# Altium schematic sheet Sheet2.SchDoc
size A4
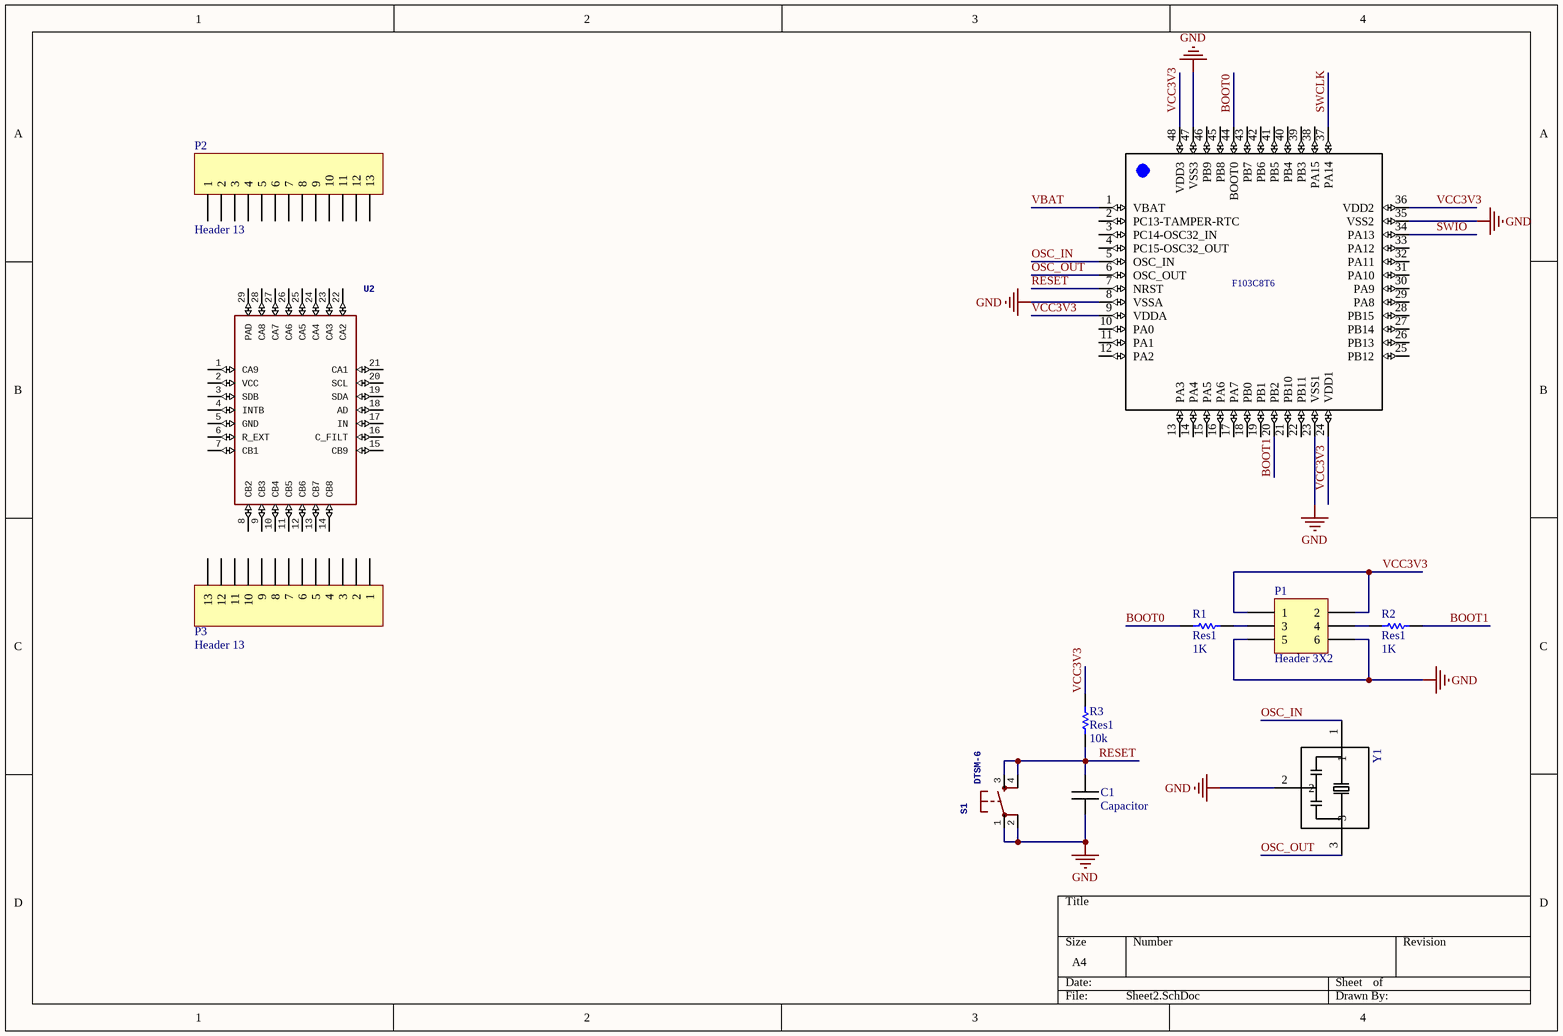
[diagram p0: Sheet2.SchDoc]

## Parts
C1  Capacitor  [C 0603 / 1608]
P1  Header 3X2  [HDR2X3]
P2  Header 13  [HDR1X13]
P3  Header 13  [HDR1X13]
R1  Res1  value 1K  [C 0603 / 1608]
R2  Res1  value 1K  [C 0603 / 1608]
R3  Res1  value 10k  [C 0603 / 1608]
S1  DTSM-6  [DTSM-6]
U1  STM32F103C8T6  [LQFP48_7X7MM_0.5MMPP]  (value not drawn)
U2  LED Lighting Drivers LED Driver   Source:  Datasheet  [QFN40P400X400X80-29N]  (value not drawn)
Y1  (no value)  [OSC_CSTCE8M00G55-R0]

## Nets
GND: C1.2 P1.5 P1.6 S1.1 S1.2 U1.8(VSSA) U1.23(VSS1) U1.35(VSS2) U1.47(VSS3) Y1.2
BOOT0: R1.1 U1.44(BOOT0)
BOOT1: R2.2 U1.20(PB2)
OSC_IN: U1.5(OSC_IN) Y1.1
OSC_OUT: U1.6(OSC_OUT) Y1.3
RESET: C1.1 R3.2 S1.3 S1.4 U1.7(NRST)
SWCLK: U1.37(PA14)
SWIO: U1.34(PA13)
VBAT: U1.1(VBAT)
VCC3V3: P1.1 P1.2 R3.1 U1.9(VDDA) U1.24(VDD1) U1.36(VDD2) U1.48(VDD3)
NetP1_3: P1.3 R1.2
NetP1_4: P1.4 R2.1

Not connected (* = marked no-connect by the designer): P2 1 2 3 4 5 6 7 8 9 10 11 12 13; P3 1 2 3 4 5 6 7 8 9 10 11 12 13; U1 2(PC13-TAMPER-RTC) 3(PC14-OSC32_IN) 4(PC15-OSC32_OUT) 10(PA0) 11(PA1) 12(PA2) 13(PA3) 14(PA4) 15(PA5) 16(PA6) 17(PA7) 18(PB0) 19(PB1) 21(PB10) 22(PB11) 25(PB12) 26(PB13) 27(PB14) 28(PB15) 29(PA8) 30(PA9) 31(PA10) 32(PA11) 33(PA12) 38(PA15) 39(PB3) 40(PB4) 41(PB5) 42(PB6) 43(PB7) 45(PB8) 46(PB9); U2 1(CA9) 2(VCC) 3(SDB) 4(INTB) 5(GND) 6(R_EXT) 7(CB1) 8(CB2) 9(CB3) 10(CB4) 11(CB5) 12(CB6) 13(CB7) 14(CB8) 15(CB9) 16(C_FILT) 17(IN) 18(AD) 19(SDA) 20(SCL) 21(CA1) 22(CA2) 23(CA3) 24(CA4) 25(CA5) 26(CA6) 27(CA7) 28(CA8) 29(PAD)

## Notes on the sheet
- (in symbol STM32F103C8T6) F103C8T6

## Library data of the parts
P1 = Header 3X2: Header, 3-Pin, Dual row; LatestRevisionDate: 17-Jul-2002; LatestRevisionNote: Re-released for DXP Platform.; Publisher: Altium Limited
P2 P3 = Header 13: Header, 13-Pin; LatestRevisionDate: 17-Jul-2002; LatestRevisionNote: Re-released for DXP Platform.; Publisher: Altium Limited
R1-R3 = Res1: Resistor; Published: 8-Jun-2000; LatestRevisionDate: 17-Jul-2002; LatestRevisionNote: Re-released for DXP Platform.; PackageReference: AXIAL-0.3; Publisher: Altium Limited; PackageDescription: Axial Device, Thru-Hole; 2 Leads; 0.3 in Pin Spacing
U1 = STM32F103C8T6: Mainstream Performance line, ARM Cortex-M3 MCU with 64 Kbytes Flash, 72 MHz CPU, motor control, USB and CAN; MF: STMicroelectronics; Price: 4.41 USD; Package: LQFP-48 STMicroelectronics; Availability: Good; MP: STM32F103C8T6; Value: *
U2 = IS31FL3731-QFLS2-TR: Manufacturer_Name: Integrated Silicon Solution Inc.; Manufacturer_Part_Number: IS31FL3731-QFLS2-TR; Arrow_Part_Number: IS31FL3731-QFLS2-TR; Arrow_Price-Stock: https://www.arrow.com/en/products/is31fl3731-qfls2-tr/integrated-silicon-solution-inc; Height: 0.8mm
Y1 = CSTCE8M00G55-R0: Ceramic Resonator 8MHz ??0.5% _Tol_ ??0.2% _Stability_ 33pF 40Ohm 3-Pin CSMD T/R; MF: Murata; SnapEDA_Link: https://www.snapeda.com/parts/CSTCE8M00G55-R0/Murata%20Electronics%20North%20America/view-part/?ref=snap; Availability: Good; MP: CSTCE8M00G55-R0; Price: 0.27 USD; Package: SMD-3 Murata; Value: *